# Altium schematic sheet Transceiver for KNx.SchDoc
size 297 x 209 mm
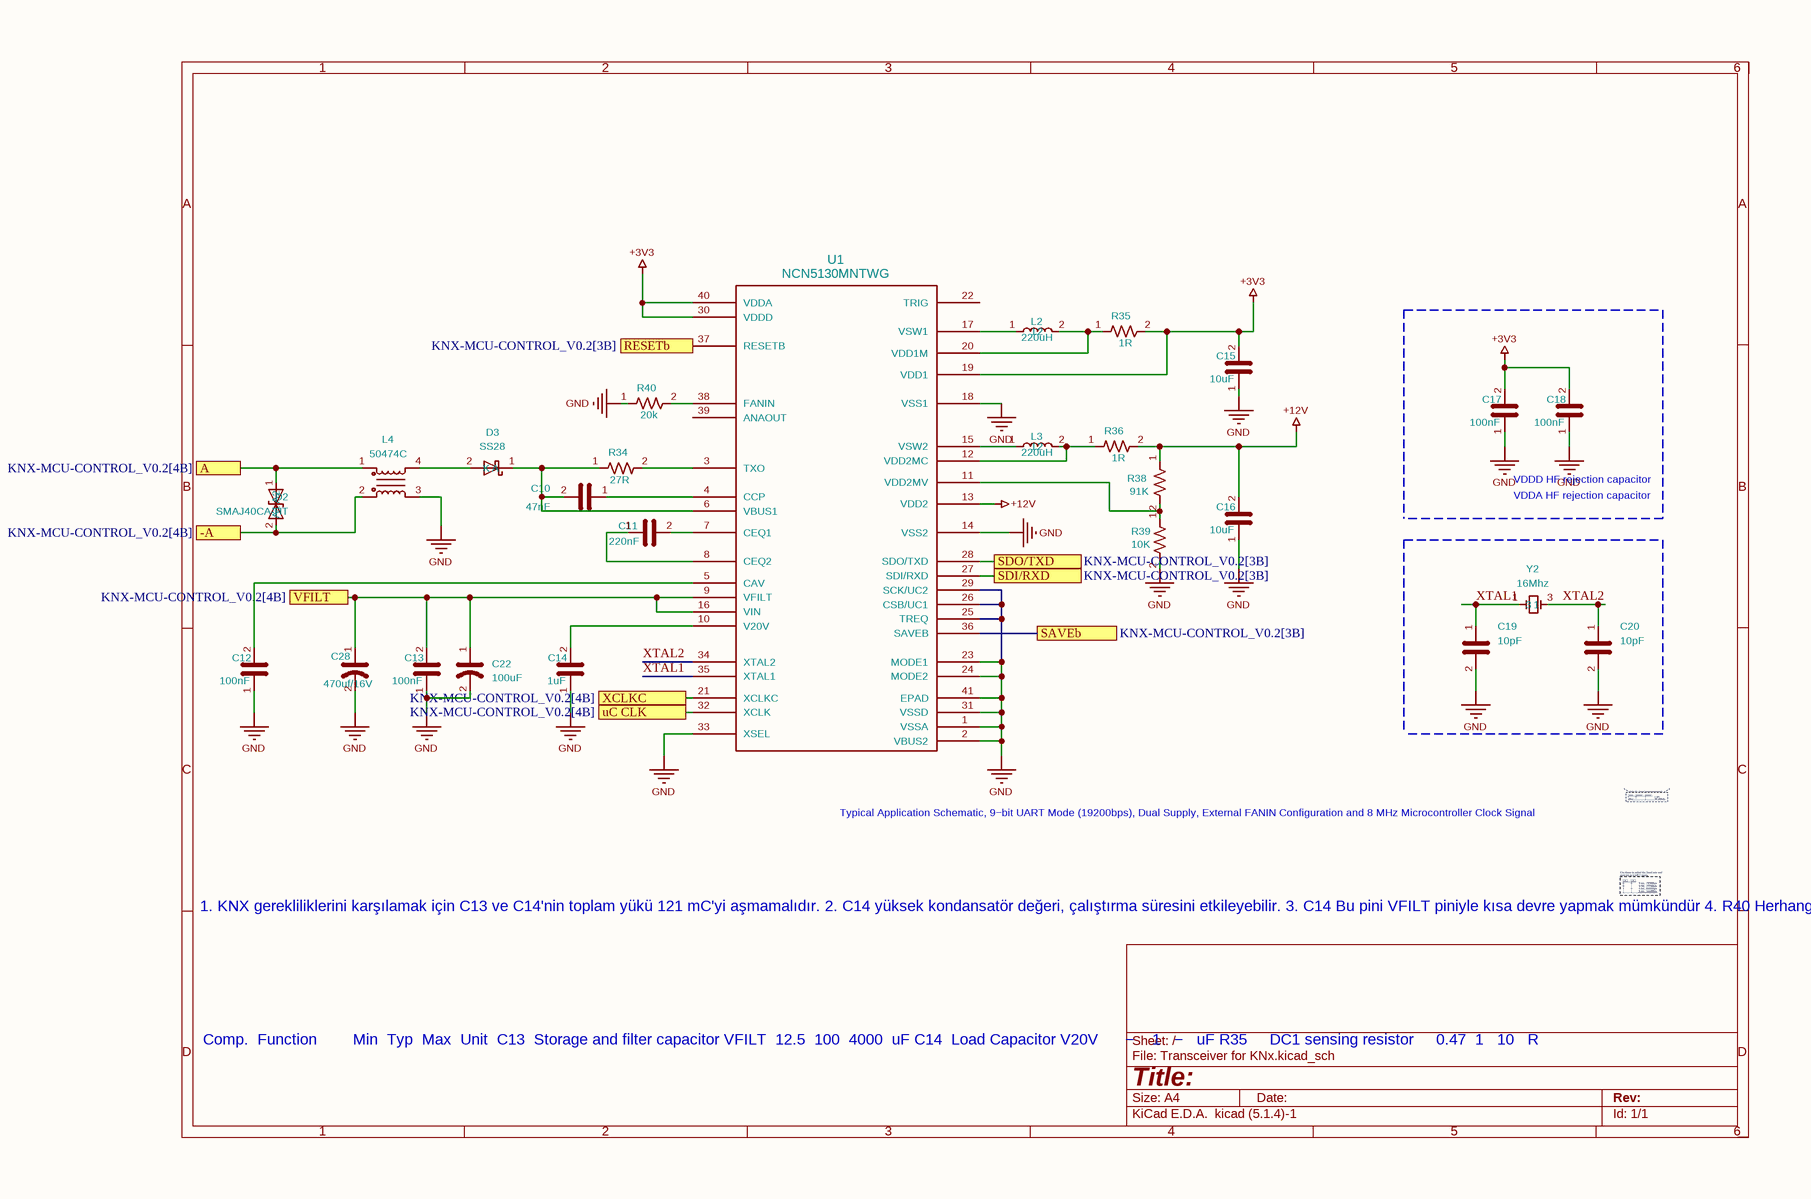
[diagram p0: Transceiver for KNx.SchDoc]

## Parts
C10  47nF  [C_0603_1608Metric]
C11  220nF  [C_0603_1608Metric]
C12  100nF  [C_0603_1608Metric]
C13  100nF  [C_0603_1608Metric]
C14  1uF  [C_0603_1608Metric]
C15  10uF  [C_0805_2012Metric]
C16  10uF  [C_0805_2012Metric]
C17  100nF  [C_0603_1608Metric]
C18  100nF  [C_0603_1608Metric]
C19  10pF  [C_0603_1608Metric]
C20  10pF  [C_0603_1608Metric]
C22  100uF  [CP_Elec_8x10]
C28  470uf/16V  [CP_Elec_8x10]
D2  SMAJ40CA-HT  [D_SMA]
D3  SS28  [D_SMA]
L2  220uH  [L_APV_ANR6028]
L3  220uH  [L_APV_ANR6028]
L4  50474C  [L_CommonMode_50474C_7.5x5.9mm]
R34  27R  [R_2512_6332Metric]
R35  1R  [R_0805_2012Metric]
R36  1R  [R_0805_2012Metric]
R38  91K  [R_0603_1608Metric]
R39  10K  [R_0603_1608Metric]
R40  20k  [R_0603_1608Metric]
U1  NCN5130MNTWG  [QFN40_485AU-01_ONS]
Y2  16Mhz  [Crystal_SMD_SeikoEpson_FA238V-4Pin_3.2x2.5mm]

## Ports
-A (see KNX-MCU-CONTROL_V0.2[4B]), A (see KNX-MCU-CONTROL_V0.2[4B]), RESETb (see KNX-MCU-CONTROL_V0.2[3B]), SAVEb (see KNX-MCU-CONTROL_V0.2[3B]), SDI/RXD (see KNX-MCU-CONTROL_V0.2[3B]), SDO/TXD (see KNX-MCU-CONTROL_V0.2[3B]), uC CLK (see KNX-MCU-CONTROL_V0.2[4B]), VFILT (see KNX-MCU-CONTROL_V0.2[4B]), XCLKC (see KNX-MCU-CONTROL_V0.2[4B])

## Nets
+3V3: C15.2 C17.2 C18.2 R35.2 U1.19(VDD1) U1.30(VDDD) U1.40(VDDA)
+12V: C16.2 R36.2 R38.1 U1.13(VDD2)
GND: C12.1 C13.1 C14.1 C15.1 C16.1 C17.1 C18.1 C19.2 C20.2 C22.2 C28.2 L4.3 R39.2 R40.1 U1.1(VSSA) U1.2(VBUS2) U1.14(VSS2) U1.18(VSS1) U1.23(MODE1) U1.24(MODE2) U1.25(TREQ) U1.26(CSB/UC1) U1.29(SCK/UC2) U1.31(VSSD) U1.33(XSEL) U1.41(EPAD)
-A: D2.2(A2) L4.2 ; port -A
A: D2.1(A1) L4.1 ; port A
RESETb: U1.37(RESETB) ; port RESETb
SAVEb: U1.36(SAVEB) ; port SAVEb
SDI/RXD: U1.27(SDI/RXD) ; port SDI/RXD
SDO/TXD: U1.28(SDO/TXD) ; port SDO/TXD
uC CLK: U1.32(XCLK) ; port uC CLK
VFILT: C13.2 C22.1 C28.1 U1.9(VFILT) U1.16(VIN) ; port VFILT
XCLKC: U1.21(XCLKC) ; port XCLKC
XTAL1: C19.1 U1.35(XTAL1) Y2.1
XTAL2: C20.1 U1.34(XTAL2) Y2.3
NetC10_1: C10.1 U1.4(CCP)
NetC10_2: C10.2 D3.1(K) R34.1 U1.6(VBUS1)
NetC11_1: C11.1 U1.8(CEQ2)
NetC11_2: C11.2 U1.7(CEQ1)
NetC12_2: C12.2 U1.5(CAV)
NetC14_2: C14.2 U1.10(V20V)
NetD3_2: D3.2(A) L4.4
NetL2_1: L2.1 U1.17(VSW1)
NetL2_2: L2.2 R35.1 U1.20(VDD1M)
NetL3_1: L3.1 U1.15(VSW2)
NetL3_2: L3.2 R36.1 U1.12(VDD2MC)
NetR34_2: R34.2 U1.3(TXO)
NetR38_2: R38.2 R39.1 U1.11(VDD2MV)
NetR40_2: R40.2 U1.38(FANIN)

Not connected (* = marked no-connect by the designer): U1 22(TRIG) 39(ANAOUT)

## Notes on the sheet
- VDDA HF rejection capacitor
- VDDD HF rejection capacitor
- Typical Application Schematic, 9−bit UART Mode (19200bps), Dual Supply, External FANIN Configuration
  and 8 MHz Microcontroller Clock Signal
- 1. KNX gerekliliklerini karşılamak için C13 ve C14'nin toplam yükü 121 mC'yi aşmamalıdır.
  2. C14 yüksek kondansatör değeri, çalıştırma süresini etkileyebilir.
  3. C14 Bu pini VFILT piniyle kısa devre yapmak mümkündür
  4. R40 Herhangi bir direnç bağlanmamışsa veya 3,3 V'a çekilmemişse, KNX cihazı 10 mA'lık bir veri
  yolu yükü olarak sertifikalandırılmalıdır. Toprağa kısa devre yapıldığında, KNX cihazı
  20 mA'lık bir veri yolu yükü olarak sertifikalandırılmalıdır. Toprağa 10 k ile 93,1 k arasında
  bir direnç bağlanırsa, cihaz 10 mA (42,2 k), 20 mA (20 k), 30 mA (13,3 k) veya 40 mA (10 k) bus yükü olarak sertifikalandırılmalıdır.
- Comp. 	Function							 Min	 Typ	 Max 	Unit
  C13 	Storage and filter capacitor VFILT 	12.5 	100 	4000 	uF
  C14 	Load Capacitor V20V					 − 		 1 		− 		uF
  R35	    DC1 sensing resistor 				0.47	 1 		10  	R
- 1
- 2
- 3
- 4
- 5
- 6
- A
- B
- C
- D
- Title:
- File: Transceiver for KNx.kicad_sch
- Sheet: /
- KiCad E.D.A.  kicad (5.1.4)-1
- Size: A4
- Date:
- Rev:
- Id: 1/1

## Library data of the parts
C10 = C_3: Manufacturer Part Number: CL10B473KB8NNNC; Manufacturer: SAMSUNG; Value: 47nF; Footprint: Capacitor_SMD:C_0603_1608Metric
C11 = C_3: Manufacturer Part Number: CL10B224KB8NNNC; Manufacturer: Samsung Electro-Mechanics; Value: 220nF; Footprint: Capacitor_SMD:C_0603_1608Metric
C12 C13 C17 C18 = C_1: Manufacturer Part Number: CL10B104KB8NNNC; Manufacturer: Samsung Electro-Mechanics; Value: 100nF; Footprint: Capacitor_SMD:C_0603_1608Metric
C14 = C_3: Manufacturer Part Number: CL10B105KP8NNNC; Manufacturer: Samsung Electro-Mechanics; Value: 1uF; Footprint: Capacitor_SMD:C_0603_1608Metric
C15 C16 = C_3: Manufacturer Part Number: CL21B106KOQNNNE; Manufacturer: Samsung Electro-Mechanics; Value: 10uF; Footprint: Capacitor_SMD:C_0805_2012Metric
C19 C20 = 20pF_0402_50V_5%: Manufacturer Part Number: CL10C100JB8NNNC; Manufacturer: Samsung Electro-Mechanics; Value: 10pF; Footprint: Capacitor_SMD:C_0603_1608Metric
C22 = C_US: Manufacturer Part Number: CD035M101F10PKKKV00A; Manufacturer: SUSCON; Value: 100uF; Footprint: Capacitor_SMD:CP_Elec_8x10
C28 = C_US: CAP.EL.470uF 16V 8x10 105C SMD; Manufacturer Part Number: EEEFK1C471P; Manufacturer: PANASONIC(EUROPE); Value: 470uf/16V; Footprint: Capacitor_SMD:CP_Elec_8x10
D2 = D_TVS: Manufacturer: HOTTECH; Manufacturer Part Number: SMAJ40CA-HT; Value: SMAJ40CA-HT; Footprint: Diode_SMD:D_SMA
D3 = SS28: Manufacturer Part Number: SS18-HT; Manufacturer: HOTTECH; Value: SS28; Footprint: Diode_SMD:D_SMA
L2 L3 = L: Manufacturer Part Number: NR6028-221M; Manufacturer: CORE MASTER; Value: 220uH; Footprint: Inductor_SMD:L_APV_ANR6028
L4 = Choke_Wurth_WE-CNSW_744232090: Manufacturer: muRata; Manufacturer Part Number: 50474C; Value: 50474C; Footprint: Me_Library:L_CommonMode_50474C_7.5x5.9mm
R34 = R_US: Manufacturer Part Number: HP122WF270JT4E; Manufacturer: ROYALOHM; Value: 27R; Footprint: Resistor_SMD:R_2512_6332Metric
R35 R36 = R_US: Manufacturer Part Number: ERJ6RQF1R0V; Manufacturer: PANASONIC; Value: 1R; Footprint: Resistor_SMD:R_0805_2012Metric
R38 = R_US: Manufacturer Part Number: 0603SAF9102T5E; Manufacturer: ROYALOHM; Value: 91K; Footprint: Resistor_SMD:R_0603_1608Metric
R39 = R_US: Manufacturer Part Number: PS03W4F1002T5E; Manufacturer: ROYALOHM; Value: 10K; Footprint: Resistor_SMD:R_0603_1608Metric
R40 = R_US: Manufacturer Part Number: 0603SAF2002T5E; Manufacturer: ROYALOHM; Value: 20k; Footprint: Resistor_SMD:R_0603_1608Metric
U1 = NCN5130MNTWG: Manufacturer: onsemi; Manufacturer Part Number: NCN5130MNTWG; Value: NCN5130MNTWG; Footprint: Me_Library:QFN40_485AU-01_ONS
Y2 = Crystal: Manufacturer Part Number: RH100-16.000-10-1010-EXT; Manufacturer: RALTRON; Value: 16Mhz; Footprint: Crystal:Crystal_SMD_SeikoEpson_FA238V-4Pin_3.2x2.5mm